# EAGLE design GlobePOV (EAGLE 5.10)
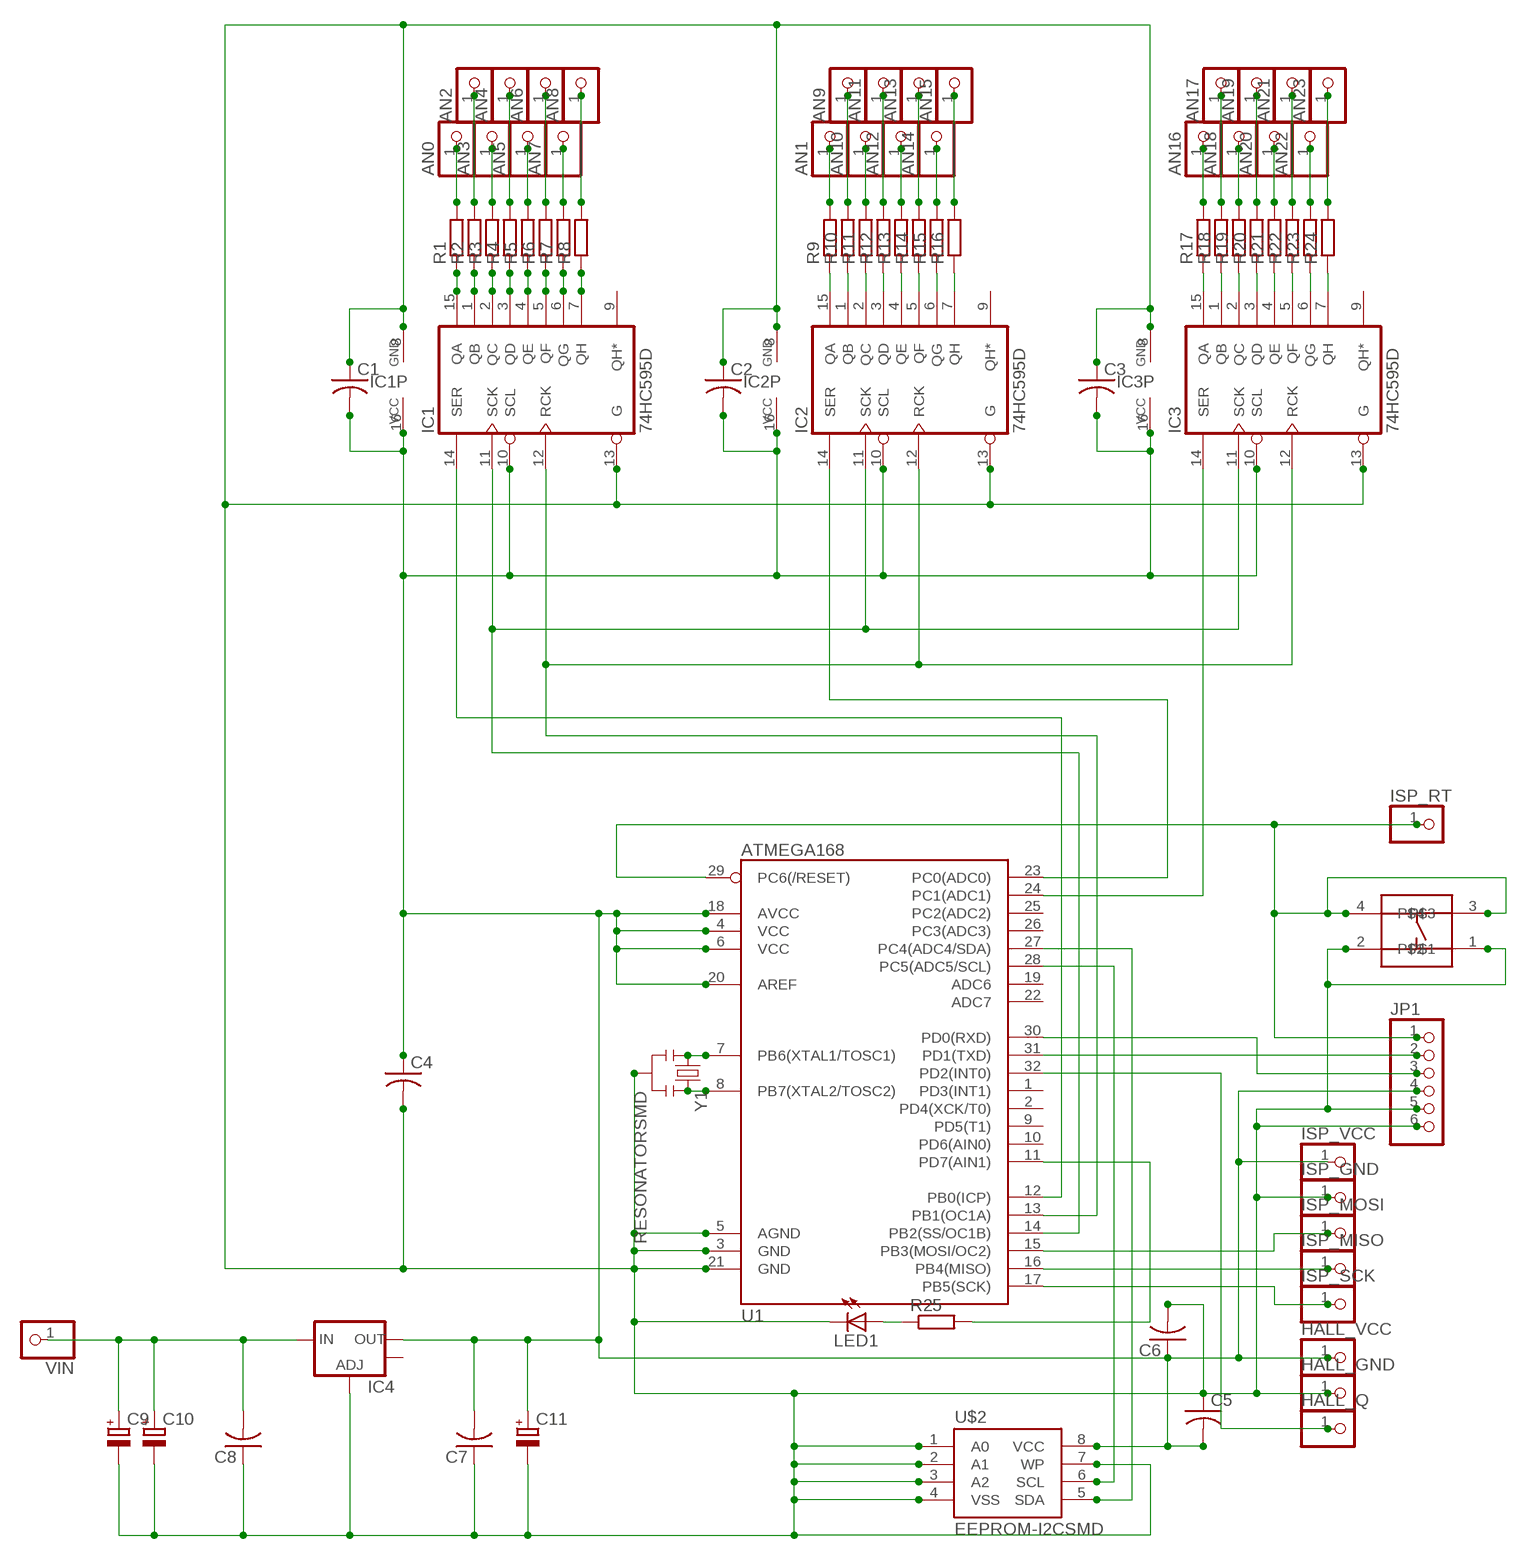
[diagram p0: schematic, sheet 1]

## Parts
AN0  PINHD-1X1  [1X01]
AN1  PINHD-1X1  [1X01]
AN2  PINHD-1X1  [1X01]
AN3  PINHD-1X1  [1X01]
AN4  PINHD-1X1  [1X01]
AN5  PINHD-1X1  [1X01]
AN6  PINHD-1X1  [1X01]
AN7  PINHD-1X1  [1X01]
AN8  PINHD-1X1  [1X01]
AN9  PINHD-1X1  [1X01]
AN10  PINHD-1X1  [1X01]
AN11  PINHD-1X1  [1X01]
AN12  PINHD-1X1  [1X01]
AN13  PINHD-1X1  [1X01]
AN14  PINHD-1X1  [1X01]
AN15  PINHD-1X1  [1X01]
AN16  PINHD-1X1  [1X01]
AN17  PINHD-1X1  [1X01]
AN18  PINHD-1X1  [1X01]
AN19  PINHD-1X1  [1X01]
AN20  PINHD-1X1  [1X01]
AN21  PINHD-1X1  [1X01]
AN22  PINHD-1X1  [1X01]
AN23  PINHD-1X1  [1X01]
C1  C-USC0805  [C0805]
C2  C-USC0805  [C0805]
C3  C-USC0805  [C0805]
C4  C-USC0805  [C0805]
C5  C-USC0805  [C0805]
C6  C-USC0805  [C0805]
C7  C-USC0805  [C0805]
C8  C-USC0805  [C0805]
C9  CPOL-EUD/7343-31R  [D/7343-31R]
C10  CPOL-EUSMCE  [SMC_E]
C11  CPOL-EUD/7343-31R  [D/7343-31R]
HALL_GND  PINHD-1X1  [1X01]
HALL_Q  PINHD-1X1  [1X01]
HALL_VCC  PINHD-1X1  [1X01]
IC1  74HC595D  [SO16]
IC2  74HC595D  [SO16]
IC3  74HC595D  [SO16]
IC4  V_REG_LM1117SOT223  [SOT223]
ISP_GND  PINHD-1X1  [1X01]
ISP_MISO  PINHD-1X1  [1X01]
ISP_MOSI  PINHD-1X1  [1X01]
ISP_RT  PINHD-1X1  [1X01]
ISP_SCK  PINHD-1X1  [1X01]
ISP_VCC  PINHD-1X1  [1X01]
JP1  PINHD-1X6  [1X06]
LED1  LEDCHIP-LED0805  [CHIP-LED0805]
R1  R-EU_R0805  [R0805]
R2  R-EU_R0805  [R0805]
R3  R-EU_R0805  [R0805]
R4  R-EU_R0805  [R0805]
R5  R-EU_R0805  [R0805]
R6  R-EU_R0805  [R0805]
R7  R-EU_R0805  [R0805]
R8  R-EU_R0805  [R0805]
R9  R-EU_R0805  [R0805]
R10  R-EU_R0805  [R0805]
R11  R-EU_R0805  [R0805]
R12  R-EU_R0805  [R0805]
R13  R-EU_R0805  [R0805]
R14  R-EU_R0805  [R0805]
R15  R-EU_R0805  [R0805]
R16  R-EU_R0805  [R0805]
R17  R-EU_R0805  [R0805]
R18  R-EU_R0805  [R0805]
R19  R-EU_R0805  [R0805]
R20  R-EU_R0805  [R0805]
R21  R-EU_R0805  [R0805]
R22  R-EU_R0805  [R0805]
R23  R-EU_R0805  [R0805]
R24  R-EU_R0805  [R0805]
R25  R-EU_R0805  [R0805]
U1  ATMEGA168  [TQFP32-08]
U$1  SMD-TACT-SW  [SMD-TACT-SW]
U$2  EEPROM-I2CSMD  [SO08]
VIN  PINHD-1X1  [1X01]
Y1  RESONATORSMD  [RESONATOR-SMD]

## Nets
GND: C1.1 C2.1 C3.1 C4.2 C5.1 C6.2 C7.1 C8.1 C9.- C10.- C11.- HALL_GND.1 IC1.8(GND) IC1.13(G) IC2.8(GND) IC2.13(G) IC3.8(GND) IC3.13(G) IC4.1(ADJ) ISP_GND.1 JP1.5 JP1.6 LED1.C U1.3(GND) U1.5(AGND) U1.21(GND) U$1.1 U$1.2 U$2.1(A0) U$2.2(A1) U$2.3(A2) U$2.4(VSS) U$2.7(WP) Y1.2
N$1: IC1.15(QA) R1.1
N$2: IC1.1(QB) R2.1
N$3: IC1.2(QC) R3.1
N$4: IC1.3(QD) R4.1
N$5: IC1.4(QE) R5.1
N$6: IC1.5(QF) R6.1
N$7: IC1.6(QG) R7.1
N$8: IC1.7(QH) R8.1
N$9: IC2.15(QA) R9.1
N$10: IC2.1(QB) R10.1
N$11: AN0.1 R1.2
N$12: AN2.1 R2.2
N$13: AN3.1 R3.2
N$14: AN4.1 R4.2
N$15: AN5.1 R5.2
N$16: AN6.1 R6.2
N$17: U1.7(PB6(XTAL1/TOSC1)) Y1.1
N$18: U1.8(PB7(XTAL2/TOSC2)) Y1.3
N$19: IC2.2(QC) R11.1
N$20: IC2.3(QD) R12.1
N$21: IC2.4(QE) R13.1
N$22: IC2.5(QF) R14.1
N$23: IC2.6(QG) R15.1
N$24: IC2.7(QH) R16.1
N$25: IC3.15(QA) R17.1
N$26: IC3.1(QB) R18.1
N$27: AN7.1 R7.2
N$28: AN8.1 R8.2
N$29: AN1.1 R9.2
N$30: AN9.1 R10.2
N$31: AN10.1 R11.2
N$32: AN11.1 R12.2
N$33: AN12.1 R13.2
N$34: AN13.1 R14.2
N$35: IC1.11(SCK) IC2.11(SCK) IC3.11(SCK) U1.14(PB2(SS/OC1B))
N$36: IC3.2(QC) R19.1
N$37: AN14.1 R15.2
N$38: AN15.1 R16.2
N$39: IC3.3(QD) R20.1
N$40: IC3.4(QE) R21.1
N$41: IC3.5(QF) R22.1
N$42: IC3.6(QG) R23.1
N$43: JP1.2 U1.31(PD1(TXD))
N$47: AN16.1 R17.2
N$48: AN17.1 R18.2
N$49: AN18.1 R19.2
N$50: AN19.1 R20.2
N$51: AN20.1 R21.2
N$52: AN21.1 R22.2
N$53: JP1.3 U1.30(PD0(RXD))
N$55: ISP_RT.1 JP1.1 U1.29(PC6(/RESET)) U$1.3 U$1.4
N$56: IC1.14(SER) U1.12(PB0(ICP))
N$57: ISP_SCK.1 U1.17(PB5(SCK))
N$59: AN22.1 R23.2
N$60: AN23.1 R24.2
N$62: IC1.12(RCK) IC2.12(RCK) IC3.12(RCK) U1.13(PB1(OC1A))
N$64: IC3.14(SER) U1.24(PC1(ADC1))
N$65: IC2.14(SER) U1.23(PC0(ADC0))
N$86: IC3.7(QH) R24.1
N$87: ISP_MISO.1 U1.16(PB4(MISO))
N$88: ISP_MOSI.1 U1.15(PB3(MOSI/OC2))
N$89: HALL_Q.1 U1.32(PD2(INT0))
N$90: U1.27(PC4(ADC4/SDA)) U$2.5(SDA)
N$91: U1.28(PC5(ADC5/SCL)) U$2.6(SCL)
N$92: LED1.A R25.1
N$93: R25.2 U1.11(PD7(AIN1))
N$94: C8.2 C9.+ C10.+ IC4.3(IN) VIN.1
VCC: C1.2 C2.2 C3.2 C4.1 C5.2 C6.1 C7.2 C11.+ HALL_VCC.1 IC1.10(SCL) IC1.16(VCC) IC2.10(SCL) IC2.16(VCC) IC3.10(SCL) IC3.16(VCC) IC4.2(OUT) ISP_VCC.1 JP1.4 U1.4(VCC) U1.6(VCC) U1.18(AVCC) U1.20(AREF) U$2.8(VCC)
Unconnected: IC1.9(QH*) IC2.9(QH*) IC3.9(QH*) IC4.4(OUT) U1.1(PD3(INT1)) U1.2(PD4(XCK/T0)) U1.9(PD5(T1)) U1.10(PD6(AIN0)) U1.19(ADC6) U1.22(ADC7) U1.25(PC2(ADC2)) U1.26(PC3(ADC3))

## Library data of the parts
AN0 AN1-AN23 HALL_GND HALL_Q HALL_VCC ISP_GND ISP_MISO ISP_MOSI ISP_RT ISP_SCK ISP_VCC VIN = adafruit:PINHD-1X1: Pin header 1x1 for 0.1" spacing With round pins
C1-C8 = adafruit:C-US: CAPACITOR, American symbol
C9-C11 = rcl:CPOL-EU: POLARIZED CAPACITOR, European symbol
IC1-IC3 = 74xx-eu:74*595: 8-bit SHIFT REGISTER, output latch
IC4 = SparkFun:V_REG_LM1117: Voltage Regulator LM1117 Standard adjustable voltage regulator but in SMD form. Spark Fun Electronics SKU : COM-00595
JP1 = adafruit:PINHD-1X6: PIN HEADER
LED1 = adafruit:LED: LED OSRAM: - CHIPLED LG R971, LG N971, LY N971, LG Q971, LY Q971, LO R971, LY R971 LH N974, LH R974 LS Q976, LO Q976, LY Q976 LO Q996 - Hyper CHIPLED LW Q18S LB Q993, LB Q99A, LB R99A - SideLED LS A670, LO A670, LY A670, LG A670, LP A670 LB A673, LV A673, LT A673, LW A673 LH A674 LY A675 LS A676, LA A676, LO A676, LY A676, LW A676 LS A679, LY A679, LG A679 - Hyper Micro SIDELED® LS Y876, LA Y876, LO Y876, LY Y876 LT Y87S - SmartLED LW L88C, LW L88S LB L89C, LB L89S, LG L890 LS L89K, LO L89K, LY L89K LS L896, LA L896, LO L896, LY L896 - TOPLED LS T670, LO T670, LY T670, LG T670, LP T670 LSG T670, LSP T670, LSY T670, LOP T670, LYG T670 LG T671, LOG T671, LSG T671 LB T673, LV T673, LT T673, LW T673 LH T674 LS T676, LA T676, LO T676, LY T676, LB T676, LH T676, LSB T676, LW T676 LB T67C, LV T67C, LT T67C, LS T67K, LO T67K, LY T67K, LW E67C LS E67B, LA E67B, LO E67B, LY E67B, LB E67C, LV E67C, LT E67C LW T67C LS T679, LY T679, LG T679 LS T770, LO T770, LY T770, LG T770, LP T770 LB T773, LV T773, LT T773, LW T773 LH T774 LS E675, LA E675, LY E675, LS T675 LS T776, LA T776, LO T776, LY T776, LB T776 LHGB T686 LT T68C, LB T68C - Hyper Mini TOPLED® LB M676 - Mini TOPLED Santana® LG M470 LS M47K, LO M47K, LY M47K Source: http://www.osram.convergy.de/
R1-R24 = rcl:R-EU_: RESISTOR, European symbol
R25 = resistor:R-EU_: RESISTOR, European symbol
U1 = SparkFun:ATMEGA168
U$1 = jasons_stuff:SMD-TACT-SW
U$2 = SparkFun:EEPROM-I2C
Y1 = SparkFun:RESONATOR: Resonator Small SMD resonator. This is the itty bitty 10/20MHz resonators with built in caps. CSTCE10M0G55 and CSTCE20M0V53. Footprint has been reviewed closely but hasn't been tested yet.

## Board
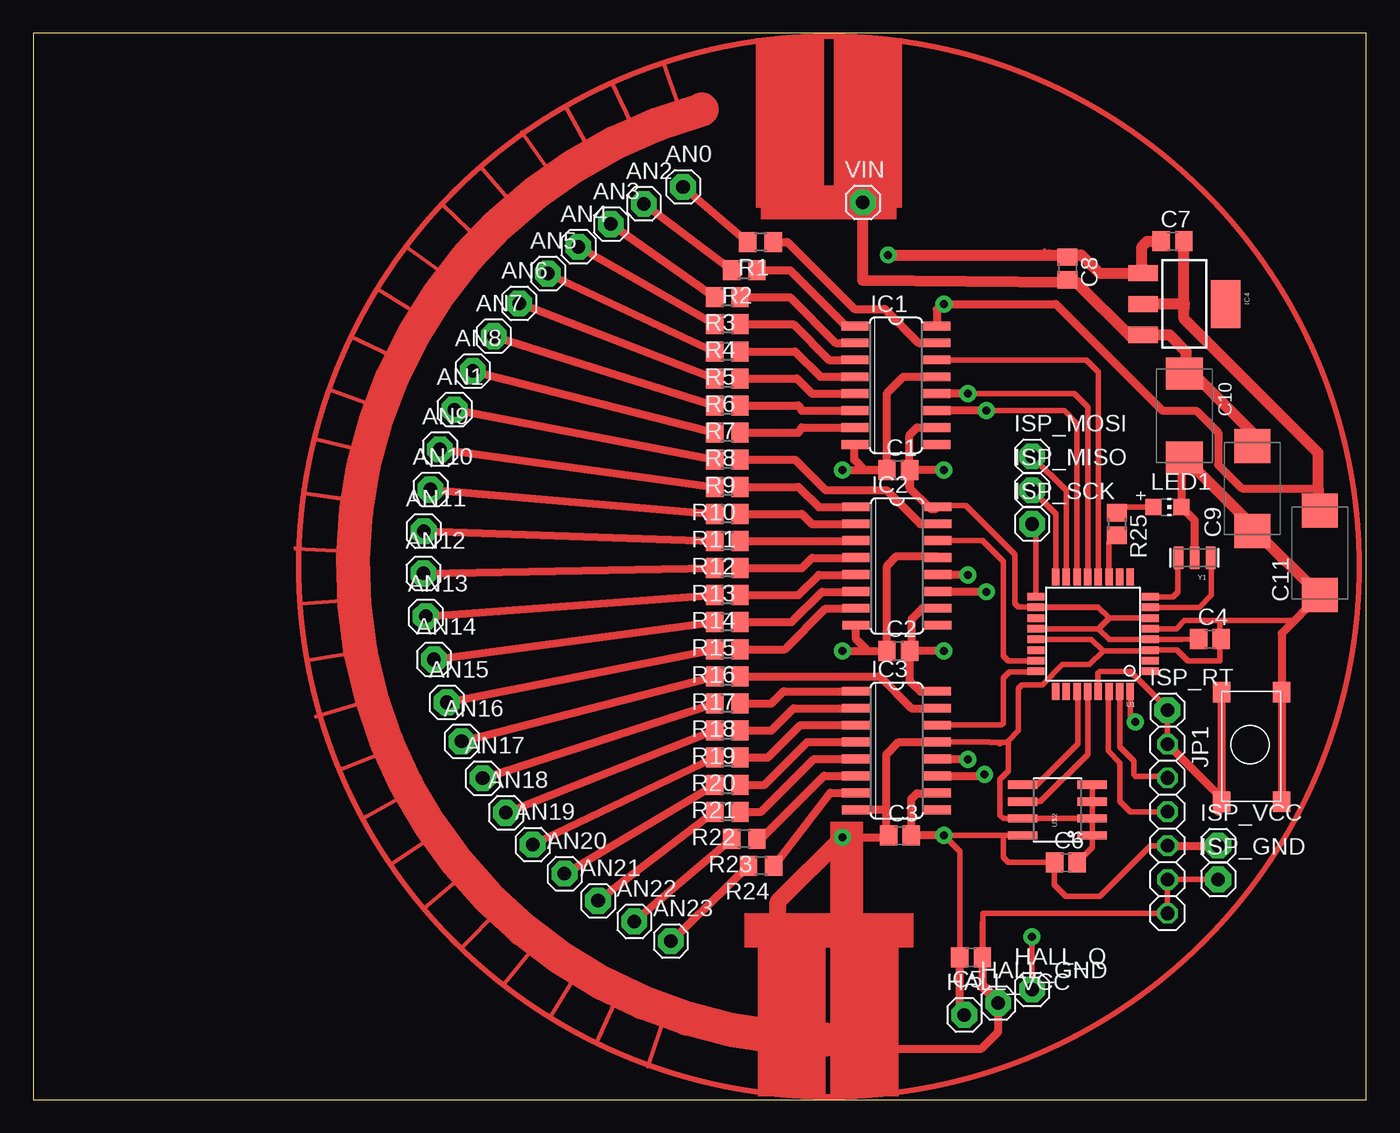
[diagram p1: board, top side]
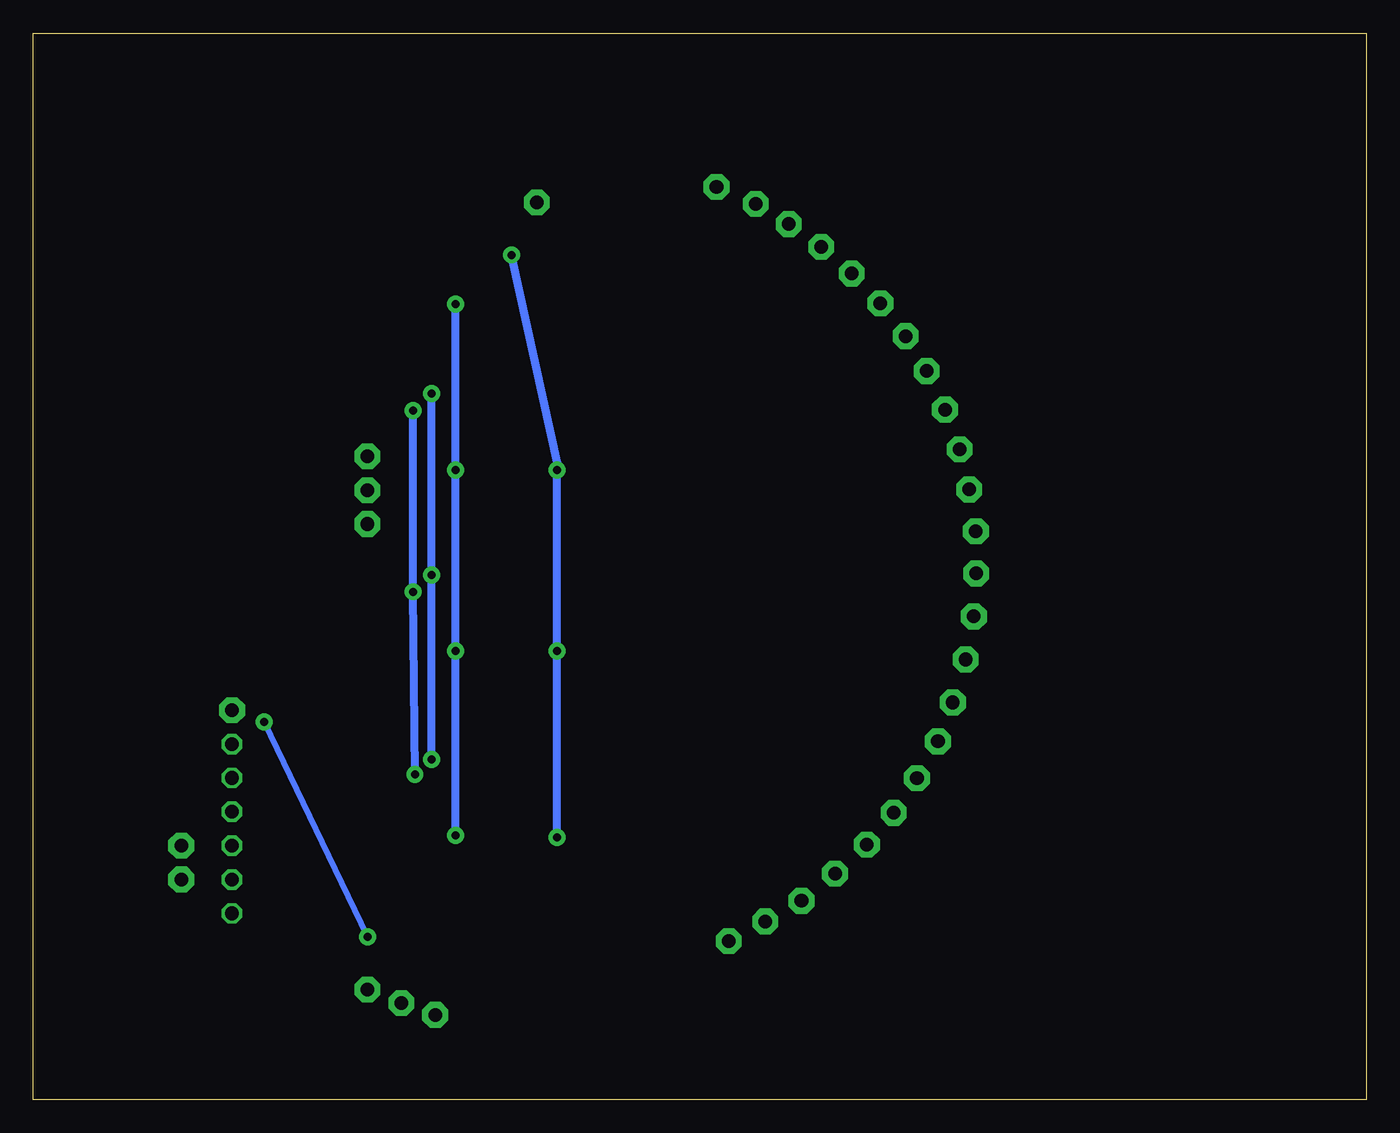
[diagram p2: board, bottom side, seen from below]

Size 100 x 80 mm. Coordinates in mm from the lower left corner, seen from the top.
Outline: 0,0 100,0 100,80 0,80 0,0
Copper layers (1*16): Top 0.035mm / dielectric 1.5mm / Bottom 0.035mm
Design rules "default *": minimum track width 10mil, minimum drill 24mil, track to track 8mil, track to pad 8mil, pad to pad 8mil, via to via 8mil, smd to smd 8mil, copper to edge 40mil, drill to drill 8mil, minimum pad ring 10mil, minimum via ring 8mil, stop-mask expansion 4mil, vias tented up to drill 0mil, thermal gap 10mil

### Footprints (pad centres in the part's own frame; a part is rotated, then mirrored left to right if it is on the bottom)
1X01 = drill 1.016 pad 1.93 octagon: 1 0,0
C0805 = smd 1.3 x 1.5: 1 -0.85,0; 2 0.85,0
D/7343-31R = smd 2.55 x 2.7: + 3.175,0; - -3.175,0
SMC_E = smd 2.4 x 2.8: + -3.15,0; - 3.15,0
SO16 = smd 0.66 x 2.032: 1 -4.445,-3.073; 2 -3.175,-3.073; 3 -1.905,-3.073; 4 -0.635,-3.073; 5 0.635,-3.073; 6 1.905,-3.073; 7 3.175,-3.073; 8 4.445,-3.073; 9 4.445,3.073; 10 3.175,3.073; 11 1.905,3.073; 12 0.635,3.073; 13 -0.635,3.073; 14 -1.905,3.073; 15 -3.175,3.073; 16 -4.445,3.073
SOT223 = smd 1.219 x 2.235: 1 -2.311,-3.099; 2 0,-3.099; 3 2.311,-3.099 | smd 3.6 x 2.2: 4 0,3.099
1X06 = drill 1.016 octagon: 1 -6.35,0; 2 -3.81,0; 3 -1.27,0; 4 1.27,0; 5 3.81,0; 6 6.35,0
CHIP-LED0805 = smd 1.2 x 1.2: A 0,-1.05; C 0,1.05
R0805 = smd 1.3 x 1.5: 1 -0.95,0; 2 0.95,0
R0805' = smd 1.3 x 1.5: 1 -0.85,0; 2 0.85,0
TQFP32-08 = smd 1.27 x 0.559: 1 -4.293,2.8; 2 -4.293,2; 3 -4.293,1.2; 4 -4.293,0.4; 5 -4.293,-0.4; 6 -4.293,-1.2; 7 -4.293,-2; 8 -4.293,-2.8; 17 4.293,-2.8; 18 4.293,-2; 19 4.293,-1.2; 20 4.293,-0.4; 21 4.293,0.4; 22 4.293,1.2; 23 4.293,2; 24 4.293,2.8 | smd 0.559 x 1.27: 9 -2.8,-4.293; 10 -2,-4.293; 11 -1.2,-4.293; 12 -0.4,-4.293; 13 0.4,-4.293; 14 1.2,-4.293; 15 2,-4.293; 16 2.8,-4.293; 25 2.8,4.293; 26 2,4.293; 27 1.2,4.293; 28 0.4,4.293; 29 -0.4,4.293; 30 -1.2,4.293; 31 -2,4.293; 32 -2.8,4.293
SMD-TACT-SW = smd 1.55 x 1.3: 1 8.2,-4.5; 2 0,-4.5; 3 8.2,0; 4 0,0
SO08 = smd 0.61 x 2.21: 1 -1.905,-2.616; 2 -0.635,-2.616; 3 0.635,-2.616; 4 1.905,-2.616; 5 1.905,2.616; 6 0.635,2.616; 7 -0.635,2.616; 8 -1.905,2.616
RESONATOR-SMD = smd 0.7 x 1.7: 1 -1.2,0; 2 0,0; 3 1.2,0

### Placement (x,y rotation side)
AN0  48.74,68.48 0 top
AN1  31.6,51.77 0 top
AN2  45.8,67.21 0 top
AN3  43.33,65.68 0 top
AN4  40.89,63.98 0 top
AN5  38.61,61.98 0 top
AN6  36.45,59.74 0 top
AN7  34.54,57.28 0 top
AN8  32.97,54.66 0 top
AN9  30.51,48.79 0 top
AN10  29.79,45.77 0 top
AN11  29.29,42.65 0 top
AN12  29.26,39.47 0 top
AN13  29.44,36.25 0 top
AN14  30.05,33.02 0 top
AN15  31.01,29.79 0 top
AN16  32.13,26.87 0 top
AN17  33.71,24.1 0 top
AN18  35.46,21.51 0 top
AN19  37.47,19.13 0 top
AN20  39.85,16.94 0 top
AN21  42.37,14.91 0 top
AN22  45.09,13.36 0 top
AN23  47.83,11.89 0 top
C1  64.9,47.24 0 top
C2  64.9,33.66 0 top
C3  65.02,19.81 0 top
C4  88.27,34.54 0 top
C5  70.36,10.67 180 top
C6  77.47,17.78 0 top
C7  85.47,64.39 0 top
C8  77.6,62.36 270 top
C9  91.44,45.85 90 top
C10  86.36,51.31 270 top
C11  96.52,41.02 90 top
HALL_GND  72.39,7.24 0 top
HALL_Q  74.93,8.26 0 top
HALL_VCC  69.85,6.35 0 top
IC1  64.72,53.59 270 top
IC2  64.8,40.03 270 top
IC3  64.77,26.19 270 top
IC4  86.36,59.69 270 top
ISP_GND  88.9,16.51 0 top
ISP_MISO  74.93,45.72 0 top
ISP_MOSI  74.93,48.26 0 top
ISP_RT  85.09,29.21 0 top
ISP_SCK  74.93,43.18 0 top
ISP_VCC  88.9,19.05 0 top
JP1  85.09,20.32 270 top
LED1  85.09,44.45 270 top
R1  54.56,64.34 180 top
R2  53.34,62.23 180 top
R3  52.07,60.2 180 top
R4  52.07,58.17 180 top
R5  52.07,56.13 180 top
R6  52.07,54.1 180 top
R7  52.07,52.07 180 top
R8  52.07,50.04 180 top
R9  52.07,48.01 180 top
R10  52.07,45.97 180 top
R11  52.07,43.94 180 top
R12  52.07,41.91 180 top
R13  52.07,39.88 180 top
R14  52.07,37.85 180 top
R15  52.07,35.81 180 top
R16  52.07,33.78 180 top
R17  52.07,31.75 180 top
R18  52.07,29.72 180 top
R19  52.07,27.69 180 top
R20  52.07,25.65 180 top
R21  52.07,23.62 180 top
R22  52.07,21.59 180 top
R23  53.34,19.56 180 top
R24  54.61,17.53 180 top
R25  [R0805']  81.28,43.18 270 top
U1  79.5,34.92 180 top
U$1  89.15,22.35 90 top
U$2  76.83,21.72 90 top
VIN  62.23,67.31 0 top
Y1  87.12,40.64 180 top

### Tracks (layer width: path | path; a pad name or v marks a point on that pad's centre or on a via)
GND  (via drill 0.6 pad 1.27)
  Top 0.305: 76.2,63.37 75.87,63.7
  Top 0.406: ISP_GND.1 JP1.5 JP1.6 71.25,13.97 | U$2.2 U$2.1 79.45,18.91 C6.2 | U$2.2 U$2.3 U$2.4 | U$2.2 U$2.7 72.77,21.08 72.52,21.34 72.52,24 73.15,24.64 73.15,26.92 | 80.26,33.66 83.72,33.66 U1.3 | U1.3 83.86,33.66 | IC3.13 71.73,26.82 71.75,26.8 72.39,26.8 | U1.3 85.78,33.73 86.61,32.89 89.03,32.89 89.03,34.63 C4.2 89.03,34.84 89.03,35.94 | U1.21 79.39,34.52 80.26,33.66 | 80.26,33.66 79.25,32.64 77.22,32.64 75.69,31.11 74.17,31.11 73.91,30.86 73.91,27.69 73.15,26.92 | 72.39,26.8 73.03,26.8 73.15,26.92 | 72.39,26.8 72.52,26.67 | C5.1 71.21,12.79 71.25,13.97 | U1.5 85.74,35.33 86.36,35.94 89.03,35.94 | 89.03,35.94 94.61,35.94 96.01,37.34 C11.- | 71.25,13.97 71.25,8.76 72.39,7.62
  Top 0.61: IC3.13 64.92,26.82 64.01,25.91 64.01,21.59 | 64.01,21.59 64.01,19.98 C3.1 64.05,19.68 v60.71,19.68 | C1.1 62.36,47.24 61.59,48.01 61.59,49.1 IC1.8 | IC2.13 67.77,40.77 64.77,40.77 64.05,40.04 C2.1 62.61,33.66 | C1.1 64.05,53 65.28,54.23 IC1.13 | IC3.8 63.86,21.74 64.01,21.59 | IC2.8 61.72,34.54 62.61,33.66 | v60.71,47.24 C1.1 | v60.71,33.66 62.61,33.66 | C5.1 71.21,8.42 HALL_GND.1 | Y1.2 87.12,43.47 LED1.C 86.14,47.94 C10.- | 72.39,7.62 72.39,5.08 71.12,3.81 60.1,3.81 59.41,4.5 | 96.01,37.34 95.69,37.01 | C11.- 93.65,34.98 U$1.1 U$1.2
  Top 0.813: 77.76,63.37 76.2,63.37 v64.14,63.37 | 77.76,63.37 78.61,63.37 79.98,62 IC4.1 83.19,62.08 83.19,64.01 83.57,64.39 C7.1 | 77.76,63.37 C8.1 | C10.- 91.44,43.08 C9.- 91.69,42.67 C11.-
  Top 1.27: 59.41,4.5 55.88,4.57 55.88,14.86 v60.71,19.68
  Top 2.54: 59.41,4.5 arc-165 50.14,74.27
  Bottom 0.61: v60.71,19.68 v60.71,33.66 v60.71,47.24 60.58,47.37 v64.14,63.37
N$1
  Top 0.61: R1.1 56.57,64.34 61.59,59.31 63.88,59.31 66.42,56.77 IC1.15
N$2
  Top 0.61: R2.1 56.77,62.23 60.96,58.04 IC1.1
N$3
  Top 0.61: R3.1 56.77,60.2 60.2,56.77 IC1.2
N$4
  Top 0.61: R4.1 57.02,58.17 59.69,55.5 IC1.3
N$5
  Top 0.61: R5.1 57.15,56.13 59.05,54.23 IC1.4
N$6
  Top 0.61: R6.1 57.28,54.1 58.42,52.96 IC1.5
N$7
  Top 0.61: R7.1 57.4,52.07 57.66,51.69 IC1.6
N$8
  Top 0.61: R8.1 57.4,50.04 57.66,50.42 IC1.7
N$9
  Top 0.61: R9.1 57.15,48.01 59.44,45.72 64.01,45.72 66.55,43.18 67.84,43.18 IC2.15
N$10
  Top 0.61: R10.1 57.4,45.97 58.93,44.45 61.7,44.45 IC2.1
N$11
  Top 0.61: AN0.1 R1.2
N$12
  Top 0.61: AN2.1 R2.2
N$13
  Top 0.61: AN3.1 R3.2
N$14
  Top 0.61: AN4.1 R4.2
N$15
  Top 0.61: AN5.1 R5.2
N$16
  Top 0.61: AN6.1 R6.2
N$17
  Top 0.406: U1.7 87.47,36.92 88.39,37.85 88.39,40.57 Y1.1
N$18
  Top 0.406: U1.8 85.48,37.73 85.85,38.1 85.85,40.57 Y1.3
N$19
  Top 0.61: R11.1 57.66,43.94 58.42,43.18 61.7,43.18 IC2.2
N$20
  Top 0.61: R12.1 61.7,41.91 IC2.3
N$21
  Top 0.61: R13.1 57.66,39.88 58.42,40.64 61.7,40.64 IC2.4
N$22
  Top 0.61: R14.1 57.4,37.85 58.93,39.37 61.7,39.37 IC2.5
N$23
  Top 0.61: R15.1 56.9,35.81 59.18,38.1 61.7,38.1 IC2.6
N$24
  Top 0.61: R16.1 56.39,33.78 59.44,36.83 61.7,36.83 IC2.7
N$25
  Top 0.61: IC3.15 65.89,29.36 63.5,31.75 R17.1
N$26
  Top 0.61: IC3.1 56.29,30.63 55.37,29.72 R18.1
N$27
  Top 0.61: AN7.1 R7.2
N$28
  Top 0.61: AN8.1 R8.2
N$29
  Top 0.61: AN1.1 R9.2
N$30
  Top 0.61: AN9.1 R10.2
N$31
  Top 0.61: AN10.1 R11.2
N$32
  Top 0.61: AN11.1 R12.2
N$33
  Top 0.61: AN12.1 R13.2
N$34
  Top 0.61: AN13.1 R14.2
N$35  (via drill 0.6 pad 1.27)
  Top 0.406: U1.14 78.3,50.73 77.34,51.69 v71.5,51.69
  Top 0.61: v71.5,51.69 IC1.11 | v71.5,38.1 67.89,38.1 IC2.11 | IC3.11 71.35,24.28 v71.37,24.38
  Bottom 0.61: v71.5,51.69 v71.5,38.1 v71.37,24.38
N$36
  Top 0.61: IC3.2 57.05,29.36 55.37,27.69 R19.1
N$37
  Top 0.61: AN14.1 R15.2
N$38
  Top 0.61: AN15.1 R16.2
N$39
  Top 0.61: IC3.3 57.56,28.09 55.12,25.65 R20.1
N$40
  Top 0.61: IC3.4 58.06,26.82 54.86,23.62 R21.1
N$41
  Top 0.61: IC3.5 58.57,25.55 54.61,21.59 R22.1
N$42
  Top 0.61: IC3.6 59.33,24.28 54.61,19.56 R23.1
N$43
  Top 0.406: U1.31 81.5,26.45 82.55,25.4 82.55,24.38 82.68,24.26 84.96,24.26 JP1.2
N$44
  Top 0.305: 48.72,73.79 47.3,77.83
N$45
  Top 0.305: 45.24,72.49 43.43,76.3
N$46
  Top 0.305: 41.99,70.76 39.93,74.55
N$47
  Top 0.61: AN16.1 R17.2
N$48
  Top 0.61: AN17.1 R18.2
N$49
  Top 0.61: AN18.1 R19.2
N$50
  Top 0.61: AN19.1 R20.2
N$51
  Top 0.61: AN20.1 R21.2
N$52
  Top 0.61: AN21.1 R22.2
N$53
  Top 0.406: JP1.3 82.3,21.59 81.53,22.35 81.53,25.27 80.64,26.16 80.64,30.57 U1.30
N$54
  Top 0.305: 39.17,69.04 36.65,72.57
N$55
  Top 0.406: U1.29 79.88,30.65 79.88,32 80.01,32.13 82.3,32.13 85.09,29.34 JP1.1 ISP_RT.1
  Top 0.61: U$1.4 89.15,22.61 JP1.1 | U$1.4 U$1.3 | U$1.4 89.15,21.84 88.9,21.59 88.9,22.1 U$1.4
N$56
  Top 0.406: U1.12 79.9,54.59 78.99,55.5 IC1.14
N$57
  Top 0.406: U1.17 75.21,42.9 ISP_SCK.1
N$58
  Top 0.305: 36.35,66.75 33.55,70
N$59
  Top 0.61: AN22.1 R23.2
N$60
  Top 0.61: AN23.1 R24.2
N$61
  Top 0.305: 33.76,64.24 30.71,67.16
N$62  (via drill 0.6 pad 1.27)
  Top 0.406: U1.13 79.1,51.96 78.11,52.96 v70.1,52.96
  Top 0.61: v70.1,52.96 IC1.12 | v70.1,39.37 67.89,39.37 IC2.12 | IC3.12 70.08,25.55 v70.1,25.53
  Bottom 0.61: v70.1,52.96 v70.1,39.37 v70.1,25.53
N$63
  Top 0.305: 27.91,64.03 31.42,61.52
N$64
  Top 0.406: IC3.14 72.64,28.09 72.77,28.22 72.77,31.62 73.25,32.1 75.18,32.1 U1.24
N$65
  Top 0.406: IC2.14 71.22,41.94 72.77,40.39 72.77,33.27 73.15,32.89 75.18,32.89 U1.23
N$67
  Top 0.305: 25.83,60.81 29.39,58.6
N$68
  Top 0.305: 27.69,55.4 23.8,57.23
N$69
  Top 0.305: 22.15,53.29 26.19,51.84
N$70
  Top 0.305: 21.06,49.61 25.25,48.56
N$71
  Top 0.305: 20.3,45.49 24.51,44.88
N$72
  Top 0.305: 20.32,45.52 24.61,44.91
N$73
  Top 0.305: 19.66,41.35 24.23,41.12
N$74
  Top 0.305: 20.09,37.21 24.26,37.52
N$75
  Top 0.305: 20.7,32.99 24.79,33.66
N$76
  Top 0.305: 21.18,28.73 25.55,30.05
N$77
  Top 0.305: 23.11,24.82 26.87,26.29
N$78
  Top 0.305: 24.97,21.21 28.45,23.14
N$79
  Top 0.305: 46.1,2.46 47.47,6.45
N$80
  Top 0.305: 42.29,4.32 43.99,8.05
N$81
  Top 0.305: 38.86,6.27 41.02,9.83
N$82
  Top 0.305: 35.38,8.74 37.92,11.84
N$83
  Top 0.305: 32.16,11.4 34.95,14.25
N$84
  Top 0.305: 29.31,14.33 32.49,16.99
N$85
  Top 0.305: 26.87,17.68 30.33,19.96
N$86
  Top 0.61: IC3.7 59.78,23.01 R24.1
N$87
  Top 0.406: U1.16 76.7,43.95 ISP_MISO.1
N$88
  Top 0.406: U1.15 77.5,45.69 ISP_MOSI.1
N$89  (via drill 0.6 pad 1.27)
  Top 0.406: U1.32 82.3,28.7 v82.68,28.32 | HALL_Q.1 v74.93,12.19
  Bottom 0.406: v74.93,12.19 v82.68,28.32
N$90
  Top 0.406: U$2.5 75.31,23.62 78.36,26.67 78.36,30.57 U1.27
N$91
  Top 0.406: U$2.6 75.56,22.35 79.12,25.91 79.12,30.61 U1.28
N$92
  Top 0.406: R25.1 81.5,44.03 81.92,44.45 LED1.A
N$93
  Top 0.406: U1.11 80.7,41.75 R25.2
N$94
  Top 0.813: VIN.1 62.23,61.47 77.76,61.34 | 77.76,61.34 78.23,61.34 82.3,57.28 83.16,57.28 IC4.3 85.24,57.38 86.49,56.13 86.49,54.59 C10.+ 87.02,54.46 91.44,50.04 C9.+ | 77.76,61.34 C8.2
VCC  (via drill 0.6 pad 1.27)
  Top 0.406: 72.9,19.81 v68.33,19.81 69.51,18.63 C5.2 | 72.9,19.81 U$2.8 | U1.18 79.92,36.92 80.72,36.12 | 80.72,36.12 U1.6 | 79.92,35.33 U1.20 79.9,35.33 80.64,36.07 80.64,36.2 79.88,36.96 73.91,36.96 73.66,37.21 73.66,40.89 69.98,44.58 67.97,44.58 IC2.16 | 79.92,35.33 80.72,36.12 | 79.92,35.33 80.72,34.52 U1.4 86.16,34.52 C4.1 | 72.9,19.81 72.77,19.68 72.77,18.16 73.15,17.78 C6.1 76.62,16.09 77.47,15.24 80.01,15.24 83.82,19.05 JP1.4
  Top 0.61: IC3.10 67.82,22.99 66.29,22.99 65.87,22.57 C3.2 v68.33,19.81 | IC1.10 66.29,50.42 65.75,49.87 C1.2 65.75,45.89 65.79,45.85 | 67.16,44.48 67.31,44.32 67.72,44.32 IC2.16 67.16,44.48 | IC2.10 66.7,36.85 65.91,36.07 65.91,33.82 C2.2 | C2.2 65.75,31.41 66.55,30.61 67.82,30.61 IC3.16 | v68.33,33.66 C2.2 | 65.79,45.85 67.16,44.48 | 65.79,45.85 65.79,47.12 65.66,47.24 v68.33,47.24 | IC1.16 67.79,59.28 v68.33,59.69 76.71,59.69 84.71,51.69 87.25,51.69 88.9,50.04 88.9,47.62 90.68,45.85 96.39,45.85 | JP1.4 ISP_VCC.1 | C5.2 69.51,6.69 HALL_VCC.1
  Top 0.813: IC4.2 86.36,59.69 86.32,59.35 | 86.32,59.35 C7.2 | 86.32,59.35 86.32,58.59 96.39,48.51 96.39,45.85 96.39,44.32 C11.+
  Bottom 0.61: v68.33,19.81 v68.33,33.66 v68.33,47.24 v68.33,59.69
(copper drawn outside any net)
  shapes: Top area x7, Top circle x1